# EAGLE design PS2 KB to serial adaptor (EAGLE 6.5.0)
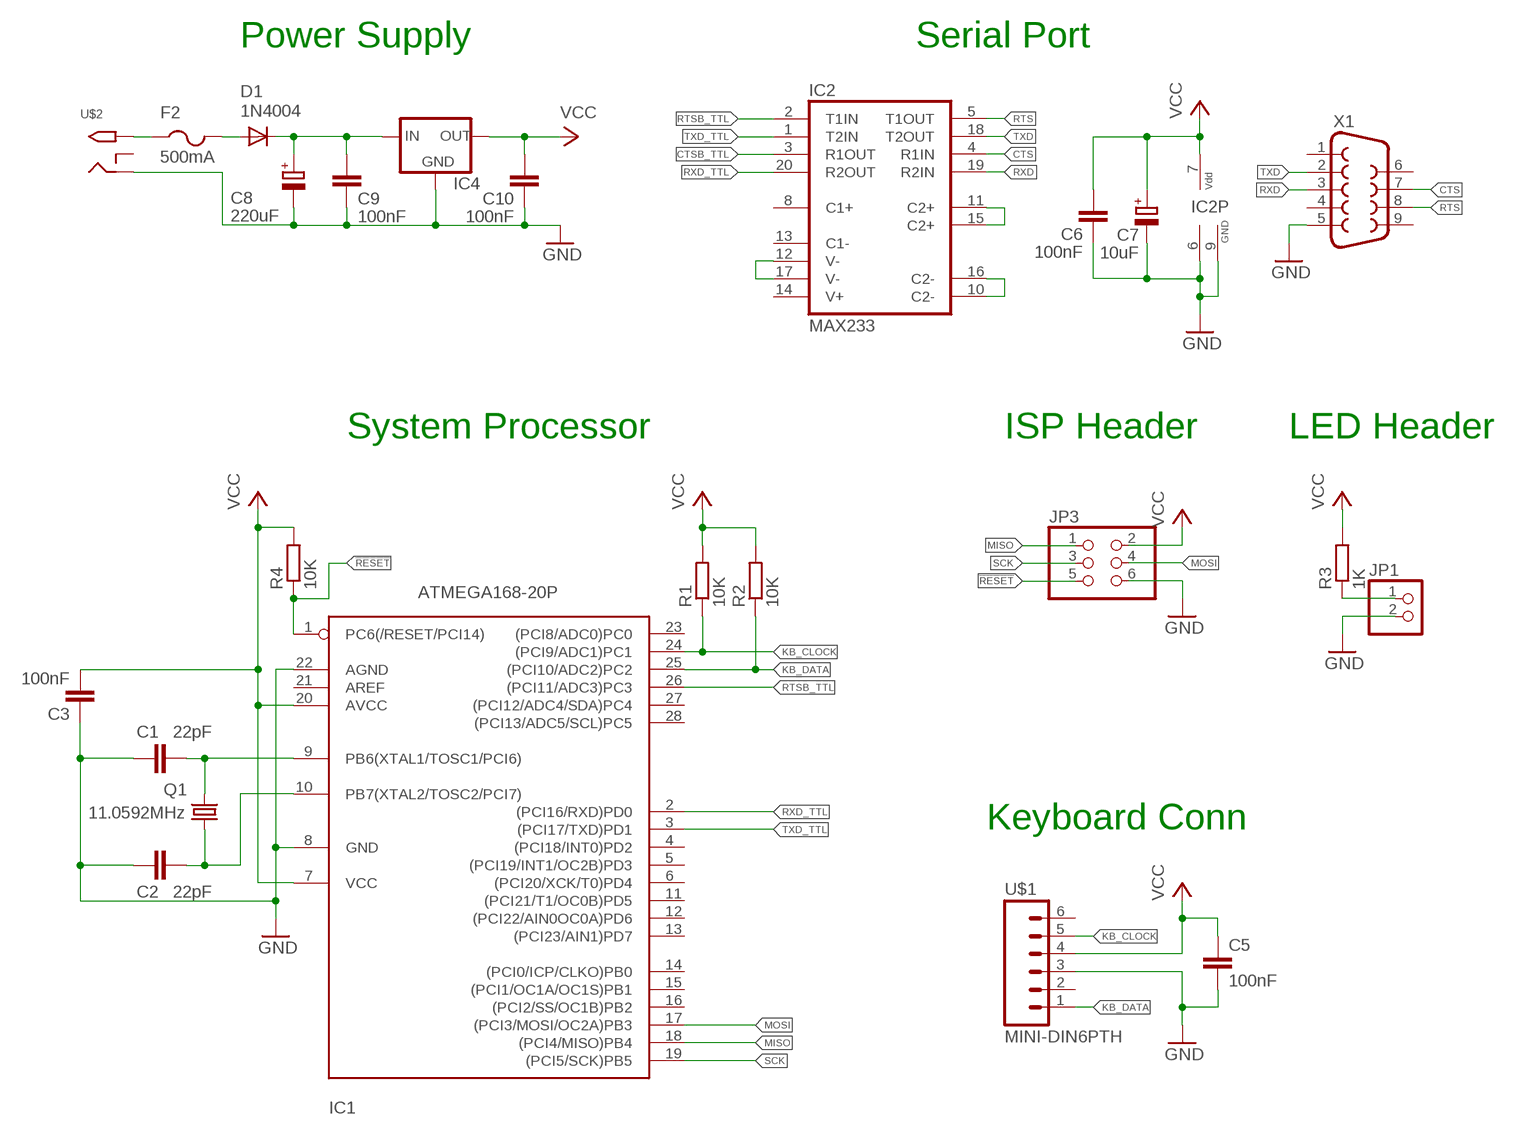
[diagram p0: schematic, sheet 1]

## Parts
C1  22pF  C-EU025-024X044  [C025-024X044]
C2  22pF  C-EU025-024X044  [C025-024X044]
C3  100nF  C-EU025-024X044  [C025-024X044]
C5  100nF  C-EU050-024X044  [C050-024X044]
C6  100nF  C-EU025-024X044  [C025-024X044]
C7  10uF  CPOL-EUE2.5-5  [E2,5-5]
C8  220uF  CPOL-EUE2.5-7  [E2,5-7]
C9  100nF  C-EU025-024X044  [C025-024X044]
C10  100nF  C-EU025-024X044  [C025-024X044]
D1  1N4004  [DO41-10]
F2  500mA  PTCFUSE-1812  [1812]
IC1  ATMEGA168-20P  [DIL28-3]
IC2  MAX233  [DIL20]
IC4  78XXL  [78XXL]
JP1  PINHD-1X2  [1X02]
JP3  PINHD-2X3  [2X03]
Q1  11.0592MHz  CRYSTALHC49U-V  [HC49U-V]
R1  10K  R-EU_0207/2V  [0207/2V]
R2  10K  R-EU_0207/2V  [0207/2V]
R3  1K  R-EU_0207/2V  [0207/2V]
R4  10K  R-EU_0207/7  [0207/7]
U$1  MINI-DIN6PTH  [MINI-DIN6]
U$2  2.1MMJACKTHM  [PJ-102A]
X1  F09HP  [F09HP]

## Nets
!RESET: IC1.1(PC6(/RESET/PCI14)) JP3.5 R4.1
CTS: IC2.4(R1IN) X1.7
CTSB_TTL: IC2.3(R1OUT)
GND: C1.1 C2.1 C3.1 C5.1 C6.1 C7.- C8.- C9.1 C10.1 IC1.8(GND) IC1.22(AGND) IC2.6(GND) IC2.9(GND) IC4.GND JP1.2 JP3.6 U$1.3 U$2.RING X1.5
KB_CLOCK: IC1.24((PCI9/ADC1)PC1) R1.1 U$1.5
KB_DATA: IC1.25((PCI10/ADC2)PC2) R2.1 U$1.1
MISO: IC1.18((PCI4/MISO)PB4) JP3.1
MOSI: IC1.17((PCI3/MOSI/OC2A)PB3) JP3.4
N$1: IC2.12(V-) IC2.17(V-)
N$2: IC2.11(C2+) IC2.15(C2+)
N$3: IC2.10(C2-) IC2.16(C2-)
N$4: C8.+ C9.2 D1.C IC4.IN
N$5: JP1.1 R3.1
N$7: D1.A F2.2
N$8: C1.2 IC1.9(PB6(XTAL1/TOSC1/PCI6)) Q1.2
N$9: C2.2 IC1.10(PB7(XTAL2/TOSC2/PCI7)) Q1.1
N$10: F2.1 U$2.TIP
RTS: IC2.5(T1OUT) X1.8
RTSB_TTL: IC1.26((PCI11/ADC3)PC3) IC2.2(T1IN)
RXD: IC2.19(R2IN) X1.3
RXD_TTL: IC1.2((PCI16/RXD)PD0) IC2.20(R2OUT)
SCK: IC1.19((PCI5/SCK)PB5) JP3.3
TXD: IC2.18(T2OUT) X1.2
TXD_TTL: IC1.3((PCI17/TXD)PD1) IC2.1(T2IN)
VCC: C3.2 C5.2 C6.2 C7.+ C10.2 IC1.7(VCC) IC1.20(AVCC) IC2.7(VDD) IC4.OUT JP3.2 R1.2 R2.2 R3.2 R4.2 U$1.4
Unconnected: IC1.4((PCI18/INT0)PD2) IC1.5((PCI19/INT1/OC2B)PD3) IC1.6((PCI20/XCK/T0)PD4) IC1.11((PCI21/T1/OC0B)PD5) IC1.12((PCI22/AIN0OC0A)PD6) IC1.13((PCI23/AIN1)PD7) IC1.14((PCI0/ICP/CLKO)PB0) IC1.15((PCI1/OC1A/OC1S)PB1) IC1.16((PCI2/SS/OC1B)PB2) IC1.21(AREF) IC1.23((PCI8/ADC0)PC0) IC1.27((PCI12/ADC4/SDA)PC4) IC1.28((PCI13/ADC5/SCL)PC5) IC2.8(C1+) IC2.13(C1-) IC2.14(V+) U$1.2 U$1.6 U$2.RING_SW X1.1 X1.4 X1.6 X1.9

## Notes on the sheet
- Power Supply | Serial Port
- System Processor | ISP Header | LED Header
- Keyboard Conn

## Library data of the parts
C1-C3 C5 C6 C9 C10 = rcl:C-EU: CAPACITOR, European symbol
C7 C8 = rcl:CPOL-EU: POLARIZED CAPACITOR, European symbol
D1 = adafruit:1N4004: DIODE General purpose 1N400x type rectifier (With bigger pads) http://www.ladyada.net/library/pcb/eaglelibrary.html
F2 = adafruit:PTCFUSE: PTC fuses, resettable thermistors
IC1 = adafruit:ATMEGA168*P: MICROCONTROLLER 16 kBytes FLASH 1 kBytes SRAM 512 Bytes EEPROM USART 8-channel 10 bit ADC
IC2 = maxim:MAX233: RS232 TRANSEIVER
IC4 = v-reg:78XXL: VOLTAGE REGULATOR
JP1 = pinhead:PINHD-1X2: PIN HEADER
JP3 = pinhead:PINHD-2X3: PIN HEADER
Q1 = crystal:CRYSTAL: CRYSTAL; OC_FARNELL: 1666969; OC_NEWARK: unknown
R1-R4 = rcl:R-EU_: RESISTOR, European symbol
U$1 = SparkFun:MINI-DIN6: mini DIN 6 Connector Commonly found on the back of a computer for PS2 keyboard and mice. Schematic and footprint are proven. Spark Fun Electronics SKU : PRT-08509
U$2 = adafruit:2.1MMJACK: 2.1mm x 5.5mm THM DC jack with internal switch. Digikey part #PJ-102A, 4UCON part #05537 2.1mm x 5.5mm SMT DC jack with internal switch. Digikey part #PJ-002A-SMT, 4UCON part #03267 By microbuilder.eu & adafruit.com
X1 = con-subd:F09: SUB-D; OC_FARNELL: unknown; OC_NEWARK: unknown

## Board
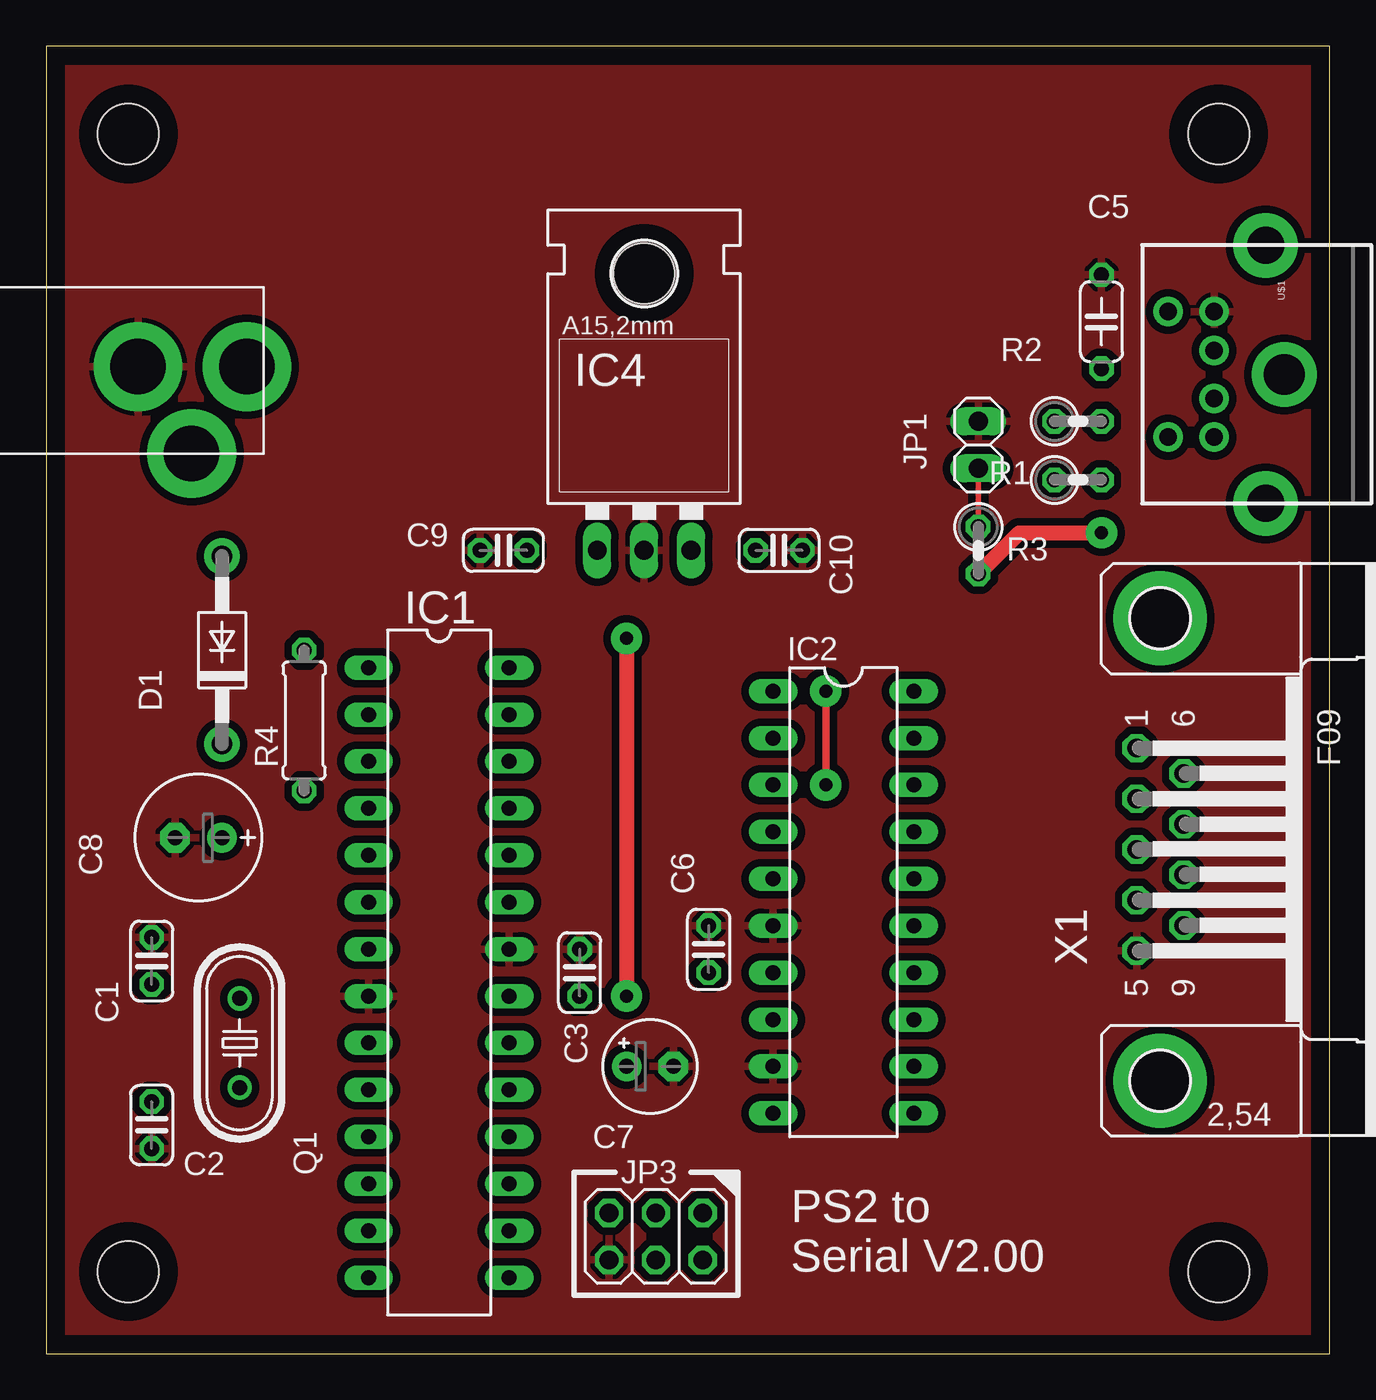
[diagram p1: board, top side]
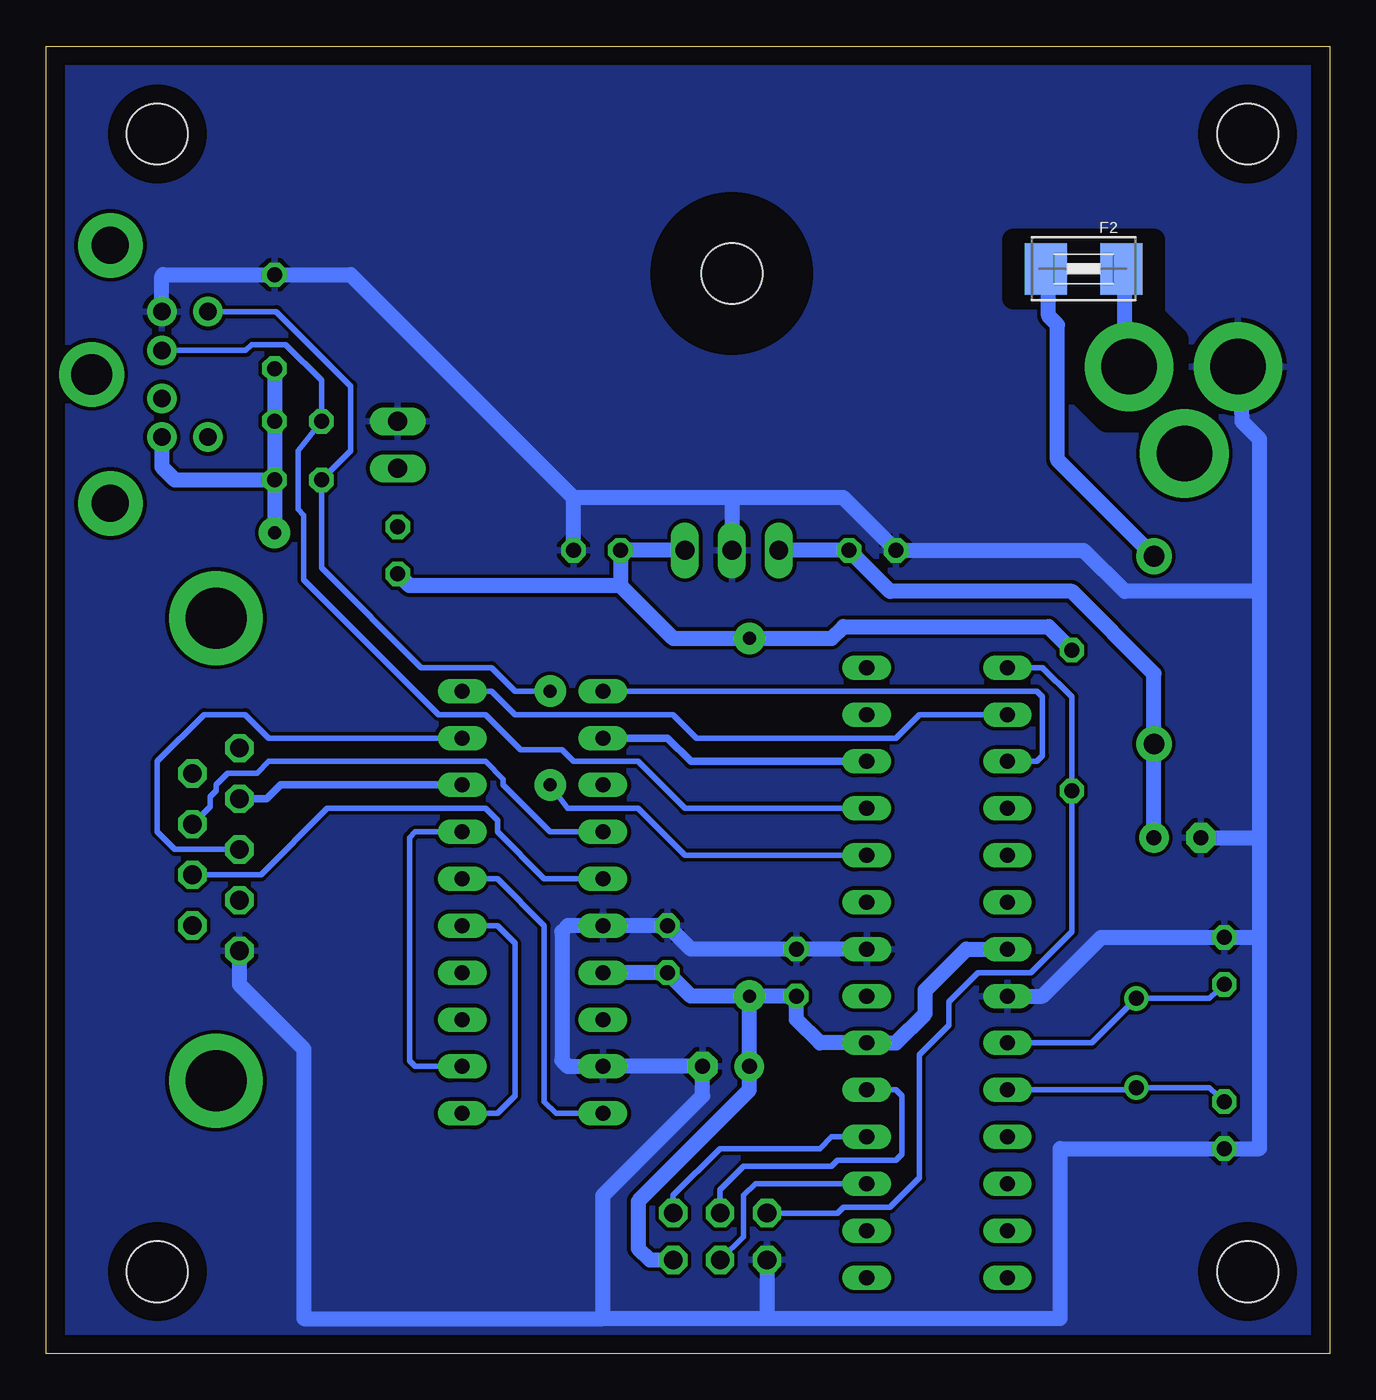
[diagram p2: board, bottom side, seen from below]

Size 69.52 x 70.79 mm. Coordinates in mm from the lower left corner, seen from the top.
Outline: 0,0 69.52,0 69.52,70.79 0,70.79 0,0
Copper layers (1*16): Top 0.035mm / dielectric 1.5mm / Bottom 0.035mm
Design rules "default": minimum track width 10mil, minimum drill 24mil, track to track 8mil, track to pad 8mil, pad to pad 8mil, via to via 8mil, smd to smd 8mil, copper to edge 40mil, drill to drill 8mil, minimum pad ring 10mil, minimum via ring 8mil, stop-mask expansion 4mil, vias tented up to drill 0mil, thermal gap 10mil
Holes 3.3 mm at 4.45,4.45 4.45,66.04 63.5,66.04 63.5,4.45
bRestrict: area 8.3,50.5 to 17.1,60.3

### Footprints (pad centres in the part's own frame; a part is rotated, then mirrored left to right if it is on the bottom)
C025-024X044 = drill 0.813 octagon: 1 -1.27,0; 2 1.27,0
C050-024X044 = drill 0.813 octagon: 1 -2.54,0; 2 2.54,0
E2,5-5 = drill 0.813 pad 1.6: + -1.27,0 | drill 0.813 pad 1.6 octagon: - 1.27,0
E2,5-7 = drill 0.813 pad 1.6: + -1.27,0 | drill 0.813 pad 1.6 octagon: - 1.27,0
DO41-10 = drill 1.118 pad 1.93: A 5.08,0; C -5.08,0
1812 = smd 2.286 x 2.794: 1 -2.046,0; 2 2.046,0
DIL28-3 = drill 0.813 long: 1 -16.51,-3.81; 2 -13.97,-3.81; 3 -11.43,-3.81; 4 -8.89,-3.81; 5 -6.35,-3.81; 6 -3.81,-3.81; 7 -1.27,-3.81; 8 1.27,-3.81; 9 3.81,-3.81; 10 6.35,-3.81; 11 8.89,-3.81; 12 11.43,-3.81; 13 13.97,-3.81; 14 16.51,-3.81; 15 16.51,3.81; 16 13.97,3.81; 17 11.43,3.81; 18 8.89,3.81; 19 6.35,3.81; 20 3.81,3.81; 21 1.27,3.81; 22 -1.27,3.81; 23 -3.81,3.81; 24 -6.35,3.81; 25 -8.89,3.81; 26 -11.43,3.81; 27 -13.97,3.81; 28 -16.51,3.81
DIL20 = drill 0.813 long: 1 -11.43,-3.81; 2 -8.89,-3.81; 3 -6.35,-3.81; 4 -3.81,-3.81; 5 -1.27,-3.81; 6 1.27,-3.81; 7 3.81,-3.81; 8 6.35,-3.81; 9 8.89,-3.81; 10 11.43,-3.81; 11 11.43,3.81; 12 8.89,3.81; 13 6.35,3.81; 14 3.81,3.81; 15 1.27,3.81; 16 -1.27,3.81; 17 -3.81,3.81; 18 -6.35,3.81; 19 -8.89,3.81; 20 -11.43,3.81
78XXL = drill 1.016 long: GND 0,-3.81; IN -2.54,-3.81; OUT 2.54,-3.81 | hole 3.302: 0,11.176
1X02 = drill 1.016 long: 1 -1.27,0; 2 1.27,0
2X03 = drill 1.016 octagon: 1 -2.54,-1.27; 2 -2.54,1.27; 3 0,-1.27; 4 0,1.27; 5 2.54,-1.27; 6 2.54,1.27
HC49U-V = drill 0.813: 1 -2.413,0; 2 2.413,0
0207/2V = drill 0.813 octagon: 1 -1.27,0; 2 1.27,0
0207/7 = drill 0.813 octagon: 1 -3.81,0; 2 3.81,0
MINI-DIN6 = drill 0.95 pad 1.6: 1 -1.3,-8.5; 2 1.3,-8.5; 3 -3.4,-8.5; 4 3.4,-8.5; 5 -3.4,-11; 6 3.4,-11 | drill 2.2 pad 3.5: P$1 0,-4.7 | drill 2 pad 3.5: P$2 -6.985,-5.715; P$3 6.985,-5.715
PJ-102A = drill 3 pad 4.8: RING 0.1,-3.39; RING_SW -4.6,-6.29; TIP 0.1,-9.29
F09HP = drill 1.016 octagon: 1 -5.486,-1.27; 2 -2.743,-1.27; 3 0,-1.27; 4 2.743,-1.27; 5 5.486,-1.27; 6 -4.115,1.27; 7 -1.372,1.27; 8 1.372,1.27; 9 4.115,1.27 | drill 3.302 pad 5.08: G1 -12.522,0; G2 12.522,0

### Placement (x,y rotation side)
C1  5.71,21.27 270 top
C2  5.71,12.38 90 top
C3  28.89,20.64 270 top
C5  57.15,55.88 270 top
C6  35.88,21.91 270 top
C7  32.7,15.56 0 top
C8  8.26,27.94 180 top
C9  24.77,43.5 0 top
C10  39.69,43.5 180 top
D1  9.53,38.1 90 top
F2  13.34,58.74 180 bottom
IC1  21.27,20.64 270 top
IC2  43.18,24.45 270 top
IC4  32.38,47.31 0 top
JP1  50.48,49.21 90 top
JP3  33.02,6.35 180 top
Q1  10.48,16.83 90 top
R1  55.88,47.31 0 top
R2  55.88,50.48 0 top
R3  50.48,43.5 270 top
R4  13.97,34.29 90 top
U$1  71.75,53.02 270 top
U$2  1.59,53.34 90 top
X1  60.33,27.3 270 top

### Tracks (layer width: path | path; a pad name or v marks a point on that pad's centre or on a via)
!RESET
  Bottom 0.305: JP3.5 26.67,7.62 26.35,7.94 23.81,7.94 22.23,9.53 22.23,16.19 20.64,17.78 20.64,19.05 19.05,20.64 16.19,20.64 13.97,22.86 R4.1 13.97,35.56 15.56,37.15 IC1.1
CTS
  Bottom 0.305: IC2.4 42.23,28.26 44.77,30.8 44.77,31.11 45.72,32.07 57.47,32.07 58.1,31.43 59.69,31.43 60.33,30.8 60.33,30.48 60.64,30.16 60.64,29.63 X1.7
GND
  Bottom 0.813: 3.81,22.54 C1.1 12.38,22.54 15.56,19.37 IC1.8 | 32.38,46.35 26.35,46.35 C9.1 13.34,43.5 11.11,41.27 3.81,41.27 | 32.38,46.35 IC4.GND | U$2.RING 4.86,53.44 4.76,50.48 3.81,49.53 3.81,41.27 | 30.48,1.91 14.61,1.91 14.61,11.11 C2.1 3.81,11.11 3.81,22.54 | JP3.6 30.48,1.91 | 30.48,1.91 39.37,1.91 | 39.37,1.91 39.37,8.57 33.97,13.97 C7.- IC2.9 41.27,15.56 41.59,15.88 41.59,22.86 41.27,23.18 IC2.6 C6.1 34.61,21.91 C3.1 IC1.22 | U$1.3 63.26,58.35 63.18,58.42 C5.1 53.02,58.42 40.96,46.35 | X1.5 59.05,20 55.56,16.51 55.56,1.91 39.37,1.91 | 3.81,41.27 3.81,27.94 | 3.81,27.94 3.81,22.54 | 32.38,46.35 40.96,46.35 | C10.1 40.96,46.35 | C8.- 3.81,27.94
  pour Bottom (isolate 0.203): -0.64,71.44 70.17,71.44 70.17,-0.95 -1.27,-1.27
  pour Top (isolate 0.406): 69.53,0 0,0 0,70.8 69.22,70.8 69.53,70.8
KB_CLOCK  (via drill 0.7 pad 1.7)
  Top 0.406: v42.23,30.8 v42.23,35.88
  Bottom 0.305: U$1.5 57.06,56.42 53.02,52.39 53.02,48.9 R1.1 54.61,42.55 49.21,37.15 45.4,37.15 44.13,35.88 v42.23,35.88 | IC1.24 34.92,26.99 37.47,29.53 41.27,29.53 v42.23,30.8
KB_DATA
  Bottom 0.305: IC1.25 34.92,29.53 37.47,32.07 40.96,32.07 41.59,32.7 43.81,32.7 45.72,34.61 48.26,34.61 55.56,41.91 55.56,45.4 55.88,45.72 55.88,48.9 R2.1 54.61,52.7 56.55,54.64 58.39,54.64 58.71,54.32 U$1.1
MISO
  Bottom 0.305: IC1.18 26.99,11.75 27.62,11.11 33.02,11.11 35.56,8.57 JP3.1
MOSI
  Bottom 0.305: JP3.4 31.75,6.35 31.75,8.57 31.11,9.21 IC1.17
N$1
  Bottom 0.305: IC2.12 49.53,15.56 49.85,15.88 49.85,27.94 49.53,28.26 IC2.17
N$2
  Bottom 0.305: IC2.11 45.09,13.02 44.13,13.97 44.13,22.23 45.09,23.18 IC2.15
N$3
  Bottom 0.305: IC2.10 41.91,13.02 42.55,13.65 42.55,23.18 45.09,25.72 IC2.16
N$4
  Bottom 0.813: IC4.IN C9.2 23.81,41.27 13.97,41.27 9.53,36.83 D1.C C8.+
N$5
  Top 0.305: JP1.1 R3.1
N$7
  Bottom 0.813: F2.2 15.24,58.6 15.24,56.2 14.75,55.7 14.75,48.4 D1.A
N$8
  Bottom 0.305: IC1.9 12.89,16.83 Q1.2 6.54,19.24 C1.2
N$9
  Bottom 0.305: IC1.10 10.6,14.29 Q1.1 6.54,14.41 C2.2
N$10
  Bottom 0.813: F2.1 11.12,58.42 11.12,53.68 U$2.TIP
RTS
  Bottom 0.305: IC2.5 42.55,25.72 45.09,28.26 45.09,28.89 45.72,29.53 54.29,29.53 57.89,25.93 X1.8
RTSB_TTL
  Bottom 0.406: IC1.26 34.61,32.07 35.88,33.34 IC2.2
RXD
  Bottom 0.305: X1.3 62.55,27.3 63.5,28.26 63.5,32.07 60.96,34.61 58.74,34.61 57.47,33.34 IC2.19
RXD_TTL
  Bottom 0.305: IC1.2 22.23,34.61 23.5,33.34 34.29,33.34 35.56,34.61 44.13,34.61 45.4,35.88 IC2.20
SCK
  Bottom 0.305: JP3.3 33.02,8.89 31.75,10.16 26.99,10.16 26.67,10.48 23.5,10.48 23.18,10.79 23.18,13.97 23.5,14.29 IC1.19
TXD
  Bottom 0.406: IC2.18 56.83,30.8 57.58,30.05 X1.2
TXD_TTL
  Bottom 0.305: IC1.3 15.88,32.07 15.56,32.38 15.56,35.56 15.88,35.88 IC2.1
VCC  (via drill 0.7 pad 1.7)
  Top 0.813: v31.43,38.73 v31.43,19.37 | R3.2 52.7,44.45 v57.15,44.45
  Bottom 0.813: U$1.4 63.26,48.02 62.55,47.31 R1.2 | IC2.7 C6.2 34.61,19.37 v31.43,19.37 | v31.43,19.37 C3.2 28.89,18.1 27.62,16.83 IC1.20 23.5,16.83 21.91,18.41 21.91,19.68 19.68,21.91 IC1.7 | JP3.2 36.83,5.08 37.47,5.71 37.47,8.26 31.43,14.29 C7.+ v31.43,19.37 | R1.2 R2.2 C5.2 | R1.2 v57.15,44.45 | IC4.OUT C10.2 38.42,41.59 | R4.2 15.24,39.37 26.35,39.37 26.99,38.73 v31.43,38.73 35.56,38.73 38.42,41.59 | 38.42,41.59 49.85,41.59 R3.2

### Text on the board
tNames: PS2 to / Serial V2.00